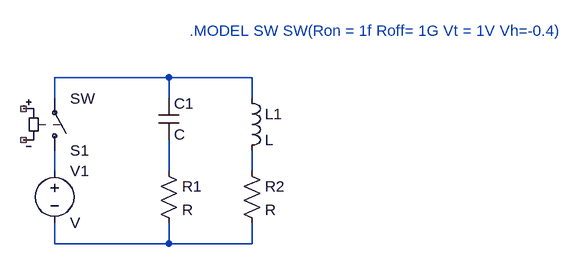
[diagram p0: schematic parte2.asc]
parte2.asc, the LTspice schematic file:
Version 4
SHEET 1 880 680
WIRE 208 80 32 80
WIRE 336 80 208 80
WIRE 32 112 32 80
WIRE 208 112 208 80
WIRE 336 112 336 80
WIRE 32 224 32 192
WIRE 208 224 208 176
WIRE 336 224 336 192
WIRE 32 336 32 304
WIRE 208 336 208 304
WIRE 208 336 32 336
WIRE 336 336 336 304
WIRE 336 336 208 336
SYMBOL voltage 32 208 R0
SYMATTR InstName V1
SYMBOL cap 192 112 R0
SYMATTR InstName C1
SYMBOL res 192 208 R0
SYMATTR InstName R1
SYMBOL ind 320 96 R0
SYMATTR InstName L1
SYMBOL res 320 208 R0
SYMATTR InstName R2
SYMBOL sw 32 208 M180
SYMATTR InstName S1
TEXT 240 8 Left 2 ;.MODEL SW SW(Ron = 1f Roff= 1G Vt = 1V Vh=-0.4)

The netlist it stands for:
* parte2.asc
V1 N002 N005 V
C1 N001 N003 C
R1 N003 N005 R
L1 N001 N004 L
R2 N004 N005 R
S1 N002 N001 NC_01 NC_02 SW
* .MODEL SW SW(Ron = 1f Roff= 1G Vt = 1V Vh=-0.4)
.backanno
.end